# EAGLE design M_D_ext_power-gv (EAGLE 9.6.2)
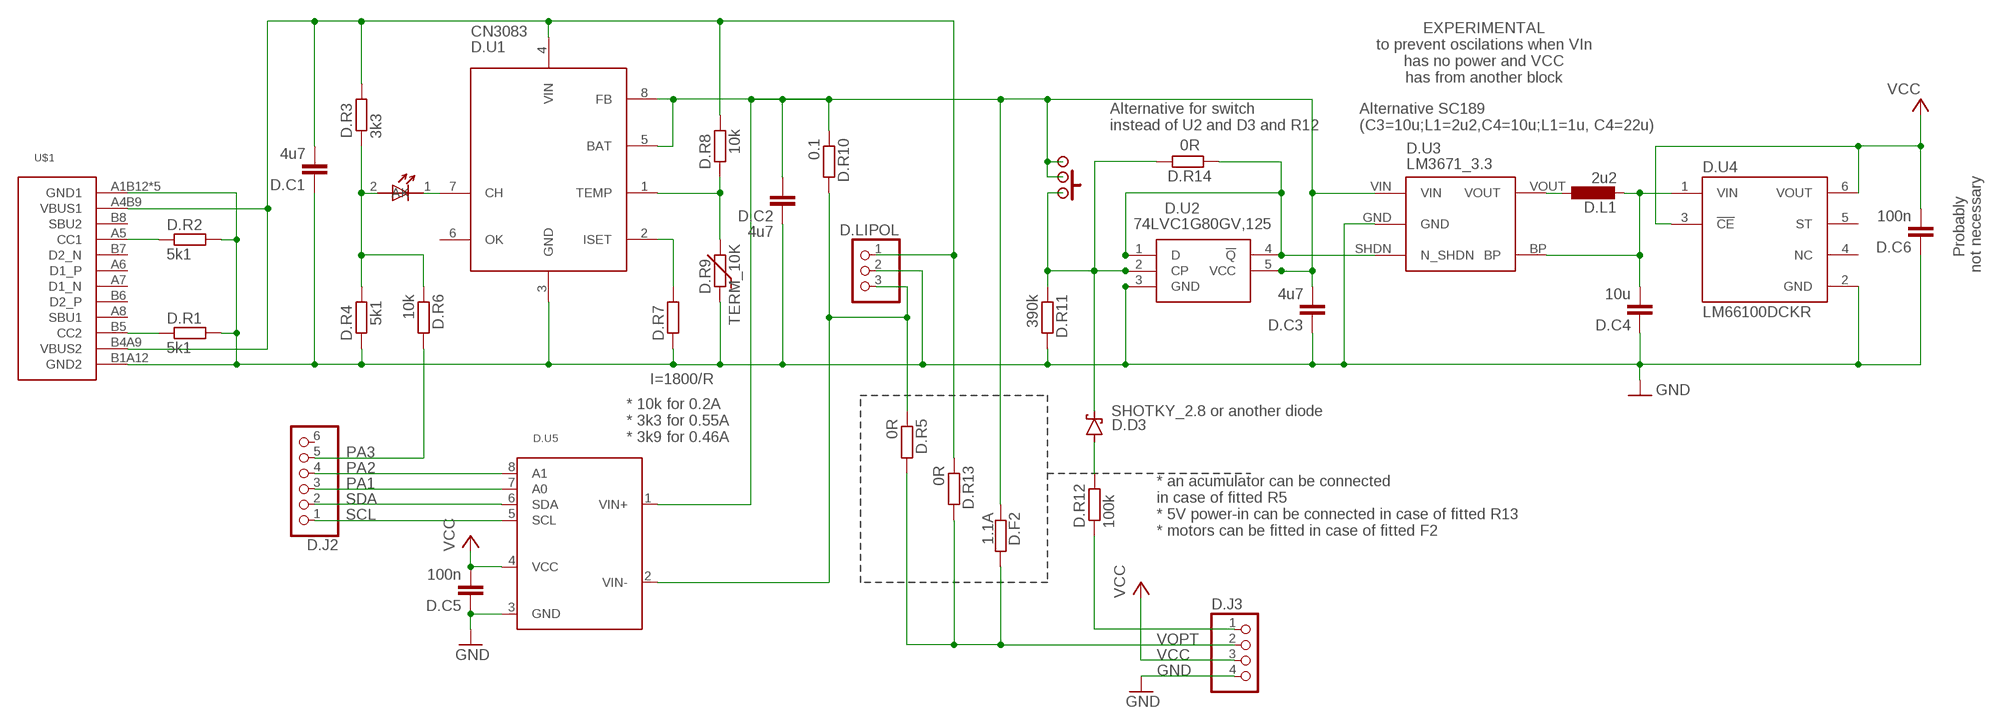
[diagram p0: schematic, sheet 1]

## Parts
D.C1  4u7  C-EUC0603  [C0603]
D.C2  4u7  C-EUC0603  [C0603]
D.C3  4u7  C-EUC0603  [C0603]
D.C4  10u  C-EUC0603  [C0603]
D.C5  100n  C-EUC0603  [C0603]
D.C6  100n  C-EUC0603  [C0603]
D.D1  LED_1.8  [LED_1.8]
D.D3  SHOTKY_2.8 or another diode  SHOTKY_2.8  [SHOTKY_2.8]
D.F2  1.1A  R-EU_R0805  [R0805]
D.J2  PINHD-1X6  [1X06]
D.J3  PINHD-1X4  [1X04]
D.L1  2u2  L-EUL3230M  [L3230M]
D.LIPOL  PINHEAD-1X3-2  [1X-03-2]
D.ON/OFF/RESET  SWITCH  [SWITCH]
D.R1  5k1  R-EU_R0603  [R0603]
D.R2  5k1  R-EU_R0603  [R0603]
D.R3  3k3  R-EU_R0603  [R0603]
D.R4  5k1  R-EU_R0603  [R0603]
D.R5  0R  R-EU_R0603  [R0603]
D.R6  10k  R-EU_R0603  [R0603]
D.R7  I=1800/R  R-EU_R0603  [R0603]
D.R8  10k  R-EU_R0603  [R0603]
D.R9  TERM_10K  THERM  [THERM]
D.R10  0.1  R-EU_R0805  [R0805]
D.R11  390k  R-EU_R0603  [R0603]
D.R12  100k  R-EU_R0603  [R0603]
D.R13  0R  R-EU_R0603  [R0603]
D.R14  0R  R-EU_R0603  [R0603]
D.U1  CN3083  [SOP8]
D.U2  74LVC1G80GV,125  [SOT95P275X110-5N]
D.U3  LM3671_3.3  STABILISER_APE8865  [SOT32-5]
D.U4  LM66100DCKR  [SOT65P210X110-6N]
D.U5  INA219  [SOT23-8]
U$1  USB-C  [USB-C]

## Nets
5V: D.C1.2 D.LIPOL.1 D.R3.2 D.R8.2 D.R13.1 D.U1.4(VIN) U$1.A4B9(VBUS1) U$1.B4A9(VBUS2)
CHRG: D.D1.2(A) D.R3.1 D.R4.2 D.R6.1
GND: D.C1.1 D.C2.1 D.C3.1 D.C4.1 D.C5.1 D.C6.1 D.J3.4 D.LIPOL.2 D.R1.2 D.R2.2 D.R4.1 D.R7.1 D.R9.1 D.R11.2 D.U1.3(GND) D.U2.3(GND) D.U3.GND D.U4.2(GND) D.U5.3(GND) U$1.A1B12(GND1) U$1.B1A12(GND2) U$1.SH1(GND1) U$1.SH2(GND1) U$1.SH3(GND1) U$1.SH4(GND1)
IN+: D.C2.2 D.C3.2 D.F2.1 D.ON/OFF/RESET.P$2 D.ON/OFF/RESET.P$3 D.ON/OFF/RESET.P$4 D.ON/OFF/RESET.P$6 D.R10.1 D.U1.5(BAT) D.U1.8(FB) D.U2.5(VCC) D.U3.VIN D.U5.1(VIN+)
IN-: D.LIPOL.3 D.R5.1 D.R10.2 D.U5.2(VIN-)
N$1: D.R14.1 D.U2.1(D) D.U2.4(!Q) D.U3.SHDN(N_SHDN)
N$2: D.L1.1 D.U3.VOUT
N$3: D.D1.1(K) D.U1.7(CH)
N$4: D.R1.1 U$1.B5(CC2)
N$5: D.D3.A D.R12.2
N$6: D.R2.1 U$1.A5(CC1)
N$7: D.R7.2 D.U1.2(ISET)
N$8: D.R8.1 D.R9.2 D.U1.1(TEMP)
N$10: D.D3.K(C) D.ON/OFF/RESET.P$1 D.ON/OFF/RESET.P$5 D.ON/OFF/RESET.P$7 D.R11.1 D.R14.2 D.U2.2(CP)
PA1: D.J2.3 D.U5.7(A0)
PA2: D.J2.4 D.U5.8(A1)
PA3: D.J2.5 D.R6.2
PA5-1: D.J3.1 D.R12.1
SCL: D.J2.1 D.U5.5(SCL)
SDA: D.J2.2 D.U5.6(SDA)
VCC: D.C5.2 D.C6.2 D.J3.3 D.U4.3(!CE) D.U4.6(VOUT) D.U5.4(VCC)
VCC1: D.C4.2 D.L1.2 D.U3.BP D.U4.1(VIN)
VOPT: D.F2.2 D.J3.2 D.R5.2 D.R13.2
Unconnected: D.J2.6 D.U1.6(OK) D.U4.4(NC) D.U4.5(ST) U$1.A6(D1_P) U$1.A7(D1_N) U$1.A8(SBU1) U$1.B6(D2_P) U$1.B7(D2_N) U$1.B8(SBU2)

## Notes on the sheet
- EXPERIMENTAL
  to prevent oscilations when VIn
  has no power and VCC
  has from another block
- Alternative for switch
  instead of U2 and D3 and R12
- Alternative SC189
  (C3=10u;L1=2u2,C4=10u;L1=1u, C4=22u)
- Probably 
  not necessary
- * 10k for 0.2A
  * 3k3 for 0.55A
  * 3k9 for 0.46A
- * an acumulator can be connected 
  in case of fitted R5  
  * 5V power-in can be connected in case of fitted R13 
  * motors can be fitted in case of fitted F2

## Library data of the parts
D.C1-D.C6 = rcl:C-EU: CAPACITOR, European symbol; SPICEPREFIX: C
D.D1 = hugo:LED_1.8
D.D3 = hugo:SHOTKY_2.8
D.F2 D.R1-D.R8 D.R10-D.R14 = rcl:R-EU_: RESISTOR, European symbol; SPICEPREFIX: R
D.J2 = pinhead2:PINHD-1X6: PIN HEADER
D.J3 = pinhead2:PINHD-1X4: PIN HEADER
D.L1 = rcl:L-EU: INDUCTOR, European symbol; SPICEPREFIX: L
D.LIPOL = pinhead2:PINHEAD-1X3-2
D.ON/OFF/RESET = hugo:SWITCH
D.R9 = hugo:THERM
D.U1 = hugo:CN3083
D.U2 = 74LVC1G80GV_125:74LVC1G80GV,125: 74LVC1G80 - Single D-type flip-flop; positive-edge trigger@en-us Source: Datasheet <https://assets.nexperia.com/documents/data-sheet/74LVC1G80.pdf>; DESCRIPTION: 74LVC1G80 - Single D-type flip-flop; positive-edge trigger@en-us; HEIGHT: 1.1mm; MANUFACTURER_NAME: Nexperia; MANUFACTURER_PART_NUMBER: 74LVC1G80GV,125
D.U3 = !stavebnice03:STABILISER_APE8865
D.U4 = LM66100DCKR:LM66100DCKR: Check availability <https://pricing.snapeda.com/parts/LM66100DCKR/Texas%20Instruments/view-part?ref=eda>; AVAILABILITY: In Stock; CHECK_PRICES: https://www.snapeda.com/parts/LM66100DCKR/Texas+Instruments/view-part/?ref=eda; DESCRIPTION: 1.5-V to 5.5-V, 1.5-A, 0.5-µA IQ ideal diode with integrated FET; MF: Texas Instruments; MP: LM66100DCKR; PACKAGE: SOT-SC70-6 Texas Instruments; PRICE: None; SNAPEDA_LINK: https://www.snapeda.com/parts/LM66100DCKR/Texas+Instruments/view-part/?ref=snap
D.U5 = hugo:INA219: INA219 - I2C Current/Power Monitor Voltage Range: 0-26V Accuracy: 0.5% Temperature: -40°C - 125°C
U$1 = hugo:USB-C

## Board
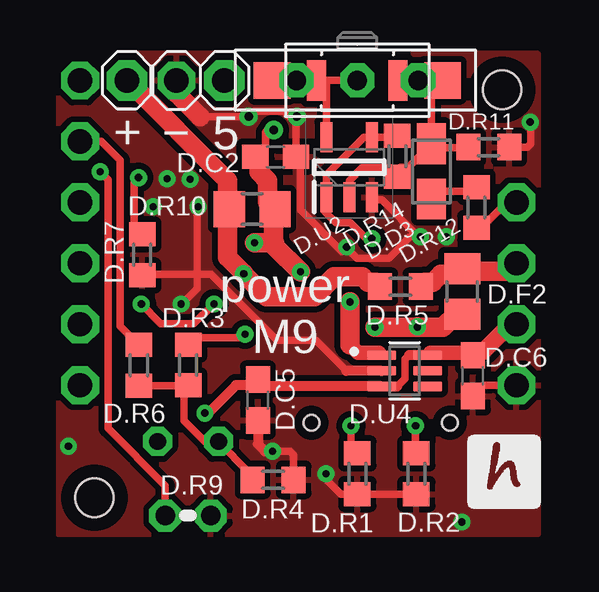
[diagram p1: board, top side]
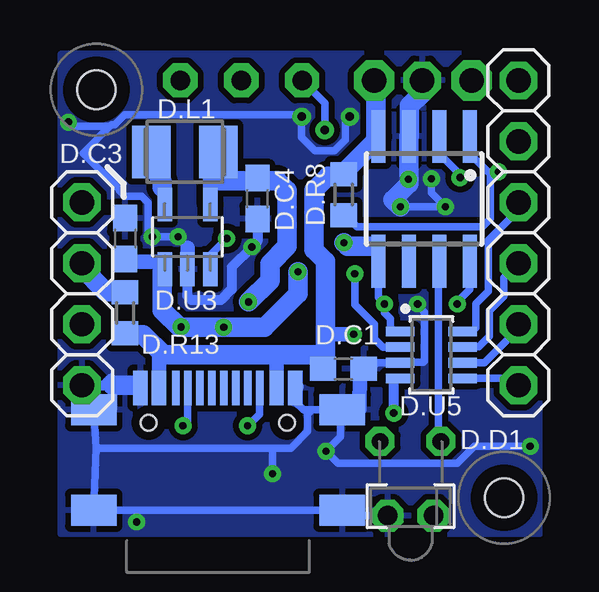
[diagram p2: board, bottom side, seen from below]

No outline drawn. Coordinates in mm, seen from the top.
Copper layers (1*16): Top 0.035mm / dielectric 1.5mm / Bottom 0.035mm
Design rules "default *": minimum track width 10mil, minimum drill 0.3mm, track to track 6mil, track to pad 6mil, pad to pad 6mil, via to via 10mil, smd to smd 10mil, copper to edge 15mil, drill to drill 15mil, minimum pad ring 10mil, minimum via ring 8mil, stop-mask expansion 4mil, vias tented up to drill 14mil, thermal gap 10mil
Holes 1.6 mm at 2,2 19,19
tRestrict: area 18,18 to 20,20; area 1,1 to 3,3
bRestrict: area 1,1 to 3,3; area 18,18 to 20,20

### Footprints (pad centres in the part's own frame; a part is rotated, then mirrored left to right if it is on the bottom)
C0603 = smd 1.1 x 1: 1 -0.85,0; 2 0.85,0
LED_1.8 = drill 0.7 octagon: 1 -1.27,-0.4; 2 1.27,-0.4
SHOTKY_2.8 = smd 1.7 x 1.2: A -1.15,0; K 1.15,0
R0805 = smd 1.3 x 1.5: 1 -0.95,0; 2 0.95,0
1X06 = drill 1.016 pad 1.575 octagon: 1 -6.35,0; 2 -3.81,0; 3 -1.27,0; 4 1.27,0; 5 3.81,0; 6 6.35,0
1X04 = drill 1.016 pad 1.575 octagon: 1 -3.81,0; 2 -1.27,0; 3 1.27,0; 4 3.81,0
L3230M = smd 1.6 x 2.2: 1 -1.4,0; 2 1.4,0
1X-03-2 = drill 1.016 pad 1.676 octagon: 1 -2.016,0; 3 2.048,0 | drill 1.016 pad 1.575 octagon: 2 -0.016,0
SWITCH = drill 0.8 pad 1.422 octagon: P$1 2.54,0; P$2 0,0; P$3 -2.54,0 | smd 0.8 x 1.7: P$4 -1.7,0; P$5 1.7,0 | smd 1.524 x 1.524: P$6 -3.556,0; P$7 3.556,0
R0603 = smd 1 x 1.1: 1 -0.85,0; 2 0.85,0
THERM = drill 0.813 octagon: 1 -0.953,0; 2 0.953,0
SOP8 = smd 0.6 x 2.2: 1 -1.905,-2.6; 2 -0.635,-2.6; 3 0.635,-2.6; 4 1.905,-2.6; 5 1.905,2.6; 6 0.635,2.6; 7 -0.635,2.6; 8 -1.905,2.6
SOT95P275X110-5N = smd 1.25 x 0.5: 1 -1.25,0.95; 2 -1.25,0; 3 -1.25,-0.95; 4 1.25,-0.95; 5 1.25,0.95
SOT32-5 = smd 0.6 x 1.4: BP 0.95,1.35; GND 0,-1.35; SHDN 0.95,-1.35; VIN -0.95,-1.35; VOUT -0.95,1.35
SOT65P210X110-6N = smd 1.19 x 0.4: 1 -0.96,0.65; 2 -0.96,0; 3 -0.96,-0.65; 4 0.96,-0.65; 5 0.96,0; 6 0.96,0.65
SOT23-8 = smd 0.4 x 1.2: 1 -0.975,-1.3; 2 -0.325,-1.3; 3 0.325,-1.3; 4 0.975,-1.3; 5 0.975,1.3; 6 0.325,1.3; 7 -0.325,1.3; 8 -0.975,1.3
USB-C = smd 0.6 x 1.45: A1B12 -3.235,3.825; A4B9 -2.46,3.825; B1A12 3.215,3.825; B4A9 2.44,3.825 | smd 0.3 x 1.45: A5 -1.26,3.825; A6 -0.26,3.825; A7 0.24,3.825; A8 1.24,3.825; B5 1.74,3.825; B6 0.74,3.825; B7 -0.76,3.825; B8 -1.76,3.825 | smd 1.9 x 1.3: SH1 -5.18,2.91; SH2 -5.18,-1.27; SH3 5.18,-1.27; SH4 5.18,2.91 | hole 0.65: 2.88,2.38; -2.9,2.38

### Placement (x,y rotation side)
D.C1  8.7,7.38 180 bottom
D.C2  9.56,16.21 180 top
D.C3  17.81,12.8 270 bottom
D.C4  12.29,14.47 90 bottom
D.C5  8.81,6.07 90 top
D.C6  17.78,7.09 90 top
D.D1  5.9,3.95 180 bottom
D.D3  16.05,15.6 90 top
D.F2  17.34,10.6 90 top
D.J2  1.4,13.04 90 bottom
D.J3  19.6,10.5 270 bottom
D.L1  15.32,16.41 0 bottom
D.LIPOL  5.4,19.39 180 top
D.ON/OFF/RESET  12.96,19.39 0 top
D.R1  12.96,3 270 top
D.R2  15.42,3 270 top
D.R3  5.91,7.54 90 top
D.R4  9.45,2.74 180 top
D.R5  14.76,10.79 0 top
D.R6  3.85,7.52 90 top
D.R7  4,12.12 90 top
D.R8  8.69,14.63 90 bottom
D.R9  5.9,1.25 180 top
D.R10  8.58,14.03 180 top
D.R11  18.44,16.61 0 top
D.R12  17.93,14.1 90 top
D.R13  17.81,9.7 90 bottom
D.R14  14.63,16.23 270 top
D.U1  5.33,14.45 180 bottom
D.U2  12.62,15.77 90 top
D.U3  15.2,12.87 0 bottom
D.U4  14.94,7.29 0 top
D.U5  5.03,7.95 270 bottom
U$1  13.93,2.75 0 bottom

### Tracks (layer width: path | path; a pad name or v marks a point on that pad's centre or on a via)
5V  (via drill 0.3)
  Top 0.305: D.R3.2 6.19,8.66 8.13,8.66 v8.28,8.81
  Bottom 0.254: 16.28,7.96 16.2,7.96
  Bottom 0.305: 9.4,8.81 9.45,8.76
  Bottom 0.61: 11.49,7.02 U$1.B4A9 11.49,7.87 11.4,7.96 | D.R8.2 8.79,15.48 8.87,15.4 | U$1.A4B9 16.39,7.84 16.28,7.96 | 7.34,17.15 D.U1.4 7.44,16.85 7.44,16.8 | v8.28,8.81 9.4,8.81
  Bottom 0.813: D.R8.2 8.69,15.55 7.44,16.8 | 8.87,15.4 9.34,15.4 9.93,14.81 9.93,12.32 9.45,11.84 9.45,8.76 9.45,7.97 9.46,7.96 9.65,7.96 | D.C1.2 9.64,7.46 9.65,7.96 | 9.65,7.96 11.4,7.96 16.2,7.96 17.04,8.8 17.75,8.8 D.R13.1 | 7.34,17.15 7.34,18.88 7.67,19.21 D.LIPOL.1
CHRG
  Top 0.305: D.R4.2 8.6,2.9 7.05,4.45 7.05,4.35 D.D1.2 7.16,4.34 6.61,4.34 5.74,5.2 5.74,6.59 | D.R6.1 5.69,6.67 5.69,6.59 5.74,6.59 | 5.74,6.59 5.82,6.59 D.R3.1
  Bottom 0.305: D.D1.2
GND  (via drill 0.3, 0.35)
  Top 0.305: v11.65,3 11.65,2.77 12.27,2.15 D.R1.2 D.R2.2 | 6.29,11.3 6.29,10.71 5.65,10.07 v5.61,10.07 | 6.29,11.3 6.29,14.12 v6.33,14.12 | 10.36,17.65 10.4,17.61 D.C2.1 10.4,16.13 10.59,16.13 10.59,13.99 12.33,12.26 12.51,12.44 | 10.36,17.65 9.91,18.11 8.66,18.11 v8.43,17.88 6.4,17.88 | 12.51,12.44 12.95,11.99 14.28,11.99 15.16,12.88 v15.6,12.88 15.52,12.88 13.99,14.41 13.57,14.41 D.U2.3 | v9.42,3.94 10.15,3.94 10.3,3.79 D.R4.1 | D.R7.1 4.03,11.3 6.29,11.3 | v12.52,12.45 12.51,12.44 | 12.5,7.29 11.23,8.56 9.6,8.56 6.86,11.3 6.29,11.3 | D.C6.1 18.23,6.69 D.J3.4 | 10.36,17.65 10.44,17.73 v10.44,17.88 | v20.17,17.65 20.19,17.63 20.19,16.75 20.05,16.61 D.R11.2
  Top 0.406: D.C5.1 8.81,4.23 9.11,3.94 v9.42,3.94 | D.U4.2 12.5,7.29
  Top 0.61: 5.44,18.84 5.42,18.89 D.LIPOL.2
  Top 0.813: 6.4,17.88 5.44,18.84
  Bottom 0.305: 11.65,4.07 18.99,4.07 19.01,4.09 | U$1.SH4 8.92,5.71 9.45,5.71 9.33,5.59 8.81,5.59 | U$1.SH1 19.01,4.09 | 19.01,4.09 U$1.SH2 U$1.SH3 8.64,1.25 D.R9.1 | 11.65,3.13 v11.65,3 | v11.65,3 11.63,2.97 | v11.65,3 11.65,4.07 | 8.04,5.68 8.13,5.59 8.81,5.59 | 8.01,7.22 D.C1.1 7.55,7.38 7.3,7.62 D.U5.3 6.31,7.64 5.37,7.64 5.32,7.7 5.32,9.73 5.65,10.06 5.65,10.07 v5.61,10.07 | U$1.B1A12 10.71,6.01 10.37,5.66 U$1.SH4 | 11.65,4.07 10.89,4.07 10.19,4.78 10.19,5.49 10.02,5.66 U$1.SH4 | 18.44,17.48 19.99,17.48 v20.17,17.65 | 15.2,12.41 15.68,12.88 16.59,12.88 16.82,13.12 16.84,13.12 16.84,14.3 17.11,14.57 17.8,14.57 18.06,14.82 18.06,14.86 19.56,16.36 18.44,17.48 | v0.91,4.14 3.24,4.14 3.95,3.44 8.93,3.44 v9.42,3.94 8.81,4.55 8.81,5.59 | v6.33,14.12 v4.45,14.12 5.03,14.71 v5.03,15.29 | 18.44,17.48 18.36,17.55 18.24,17.55 17.83,17.96 10.52,17.96 v10.44,17.88 10.44,17.03 9.88,16.46 9.08,16.46 8.62,16.92 8.62,17.7 v8.43,17.88
  Bottom 0.406: 18.37,6.98 18.5,6.85 | 18.5,6.85 18.66,6.69 | U$1.A1B12 17.16,6.6 17.33,6.77 17.41,6.69 | 18.66,6.69 D.J3.4 19.6,6.25 | 18.66,6.69 18.31,6.69 | 18.5,6.85 18.34,6.68 18.34,5.71 | D.C4.1 12.29,12.68 v12.52,12.45 13.36,11.61 13.36,10.68 13.8,10.24 15.04,10.24 15.2,10.4 D.U3.GND
  Bottom 0.61: 8.81,5.84 8.87,5.79 U$1.SH4 8.74,5.79 | 19.6,6.25 U$1.SH1 | U$1.B1A12 10.66,6.63 | D.U1.3 5.97,18.23 | 8.04,5.68 8.01,7.22 | D.U3.GND 15.2,12.41 | D.LIPOL.2 5.42,18.86
  Bottom 0.813: 18.31,6.69 17.41,6.69 | v6.33,14.12 6.63,14.43 5.97,15.09 D.U1.3 5.94,17.08 5.94,18.33 5.42,18.86
  other vias: 5.99,15.27 16.67,12.88 17.32,0.99
  pour Top (isolate 0.254): 0.5,20.5 0.5,0.5 20.5,0.5 20.5,20.5
  pour Bottom (isolate 0.254, rank 3): 0.5,20.5 20.5,20.5 20.5,0.5 0.5,0.5
IN+  (via drill 0.3, 0.35)
  Top 0.305: D.ON/OFF/RESET.P$6 D.ON/OFF/RESET.P$3 D.ON/OFF/RESET.P$4 11.68,19.39 | D.ON/OFF/RESET.P$2 11.68,19.39 | v3.96,10.07 4.77,9.26 6.13,9.26 v6.99,10.07 | D.C2.2 9.14,16.64 9.14,17.24 9.22,17.33 v9.48,17.33 | D.U2.5 11.67,19.38 11.68,19.39
  Top 0.508: 14.79,9.1 15.32,9.1
  Top 0.61: v8.68,12.62 9.52,12.62
  Top 0.813: D.R10.1 9.22,14.33 9.22,15.21 8.86,15.58 8.86,16.06 D.C2.2 | D.R10.1 9.61,14.03 | D.R10.1 9.47,13.97 9.47,12.62 v8.68,12.62 | 17.35,9.6 17.34,9.61 D.F2.1 17.08,9.65 16.54,9.1 15.45,9.1 | v15.47,9.12 15.45,9.1 | 15.45,9.1 15.32,9.1 14.83,9.1 | v13.69,9.1 14.79,9.1 | 9.52,12.62 9.52,12.49 v10.59,11.42
  Bottom 0.305: D.U3.VIN 16.15,11.82 | D.C3.2 17.59,11.74 17.6,11.82 | 13.51,9.28 v13.69,9.1 | D.U5.1 6.56,8.93 6.74,9.1 6.74,9.47 6.99,9.72 v6.99,10.07 7.24,10.36 D.U1.5 | v3.96,10.07 3.96,10.16 3.43,10.68 D.U1.8 | v9.48,17.33 9.48,18.45 D.ON/OFF/RESET.P$3
  Bottom 0.508: 7.37,12.47 7.24,12.6 | 7.24,12.42 7.19,12.47
  Bottom 0.61: 7.24,12.45 D.U1.5 7.24,12.42 7.24,12.6 | 17.6,11.82 16.15,11.82 | D.U3.VIN 16.25,11.42
  Bottom 0.813: v8.68,12.62 8.53,12.47 7.37,12.47 | 16.25,11.42 16.25,9.82 15.54,9.1 v13.69,9.1 11.98,9.1 10.59,10.49 v10.59,11.42
IN-  (via drill 0.3)
  Top 0.813: D.LIPOL.3 3.38,19.39 7.55,15.22 7.55,14.33 7.62,14.25 D.R10.2 7.62,13.57 7.54,13.49 7.54,12.03 8.23,11.35 v8.23,11.33 9.18,10.38 11.17,10.38 11.99,11.2 13.17,11.2 13.4,10.97 13.73,10.97 D.R5.1
  Bottom 0.305: D.U5.2 6.34,8.27 7.05,8.27 7.41,8.63 7.41,9.23 8.23,10.04 v8.23,11.33
N$1  (via drill 0.3)
  Top 0.305: D.R14.1 14.57,17.02 D.U2.4 13.23,17.02 11.67,15.46 D.U2.1 11.61,14.46 11.61,13.93 12.07,13.47 12.68,13.47 13.35,12.8 v13.56,12.8
  Bottom 0.305: D.U3.SHDN 14.25,12.11 v13.56,12.8
N$2
  Bottom 0.305: 16.25,14.93 16.15,14.83 D.U3.VOUT
  Bottom 0.61: D.L1.1 16.72,15.62 16.25,15.16
  Bottom 0.813: 16.25,15.16 16.25,14.93
N$3
  Bottom 0.305: D.U1.7 4.75,11.8 4.75,4.47 D.D1.1
N$4  (via drill 0.3)
  Top 0.305: D.R1.1 12.69,4.14 v12.69,5
  Bottom 0.305: U$1.B5 12.19,5.48 12.67,5 v12.69,5
N$5
  Top 0.305: D.R12.2 17.52,14.78 16.38,14.78 D.D3.A
N$6  (via drill 0.3)
  Top 0.305: D.R2.1 15.39,3.88 v15.39,5
  Bottom 0.305: U$1.A5 15.19,5.2 v15.39,5
N$7  (via drill 0.3)
  Top 0.305: v3.83,15.34 3.66,15.16 3.66,13.31 D.R7.2
  Bottom 0.305: D.U1.2 4.57,16.93 4.57,16.21 3.83,15.48 v3.83,15.34
N$8  (via drill 0.3)
  Top 0.305: D.R9.2 4.95,2.51 2.56,4.89 2.56,15.26 v2.24,15.59
  Bottom 0.305: D.U1.1 3.4,17.03 3.4,16.32 2.67,15.59 v2.24,15.59 2.42,15.59 2.57,15.43 2.57,13.63 2.9,13.3 8.13,13.3 8.61,13.78 D.R8.1
N$10
  Top 0.305: D.ON/OFF/RESET.P$1 D.ON/OFF/RESET.P$5 15.85,19.39 16.05,19.18 D.D3.K | D.ON/OFF/RESET.P$1 15.36,19.35 | D.ON/OFF/RESET.P$1 D.ON/OFF/RESET.P$7 | 17.36,16.84 D.R11.1 17.57,16.59 16.2,16.59 D.D3.K | 14.25,15.38 D.R14.2 14.63,15.49 | 14.63,15.49 14.63,15.65 14.76,15.78 15.09,15.78 D.D3.K | D.U2.2 12.62,15.21 13.16,15.75 14.38,15.75 14.63,15.49
PA1
  Bottom 0.305: D.U5.7 3.71,8.29 3.05,8.29 2.62,8.73 2.62,9.78 2.01,10.39 2.01,11.16 D.J2.3
PA2
  Bottom 0.305: D.J2.4 1.4,13.98 2.65,12.73 2.65,10.6 3.17,10.08 3.17,9.08 3.32,8.93 D.U5.8
PA3
  Top 0.305: D.R6.2 3.07,9.15 3.07,16.07 2.29,16.85 D.J2.5
PA5-1
  Top 0.305: D.R12.1 18.09,13.4 18.28,13.4 19.19,14.31 D.J3.1
SCL
  Bottom 0.305: D.U5.5 1.69,6.97 D.J2.1
SDA
  Bottom 0.305: D.J2.2 1.4,9.04 2.82,7.62 D.U5.6
VCC  (via drill 0.3)
  Top 0.305: 14.62,6.63 14.95,6.97 14.95,7.77 15.12,7.94 | D.U4.6 16,8.05 | D.C6.2 19.07,9.23 D.J3.3
  Top 0.406: v6.6,5.53 6.74,5.53 7.9,6.69 8.59,6.69 D.C5.2 9.09,6.64 D.U4.3 14.62,6.63 | D.U4.6 15.12,7.94
  Top 0.61: D.J3.3 19.4,9.23 18.21,8.05 16,8.05
  Bottom 0.305: 6.6,6.8 6.43,6.97 D.U5.4
  Bottom 0.406: v6.6,5.53 6.6,6.8
VCC1  (via drill 0.3)
  Top 0.305: D.U4.1 13.87,8.04
  Top 0.61: v12.65,10.16 | 13.87,8.04 12.99,8.04 12.65,8.38
  Top 0.813: v12.65,10.16 12.65,8.38
  Bottom 0.406: D.U3.BP 14.25,14.45 | D.C4.2 12.18,15.21 12.13,15.21
  Bottom 0.508: 14.25,16.07 D.L1.2
  Bottom 0.61: D.U3.BP 14.25,16.07
  Bottom 0.813: v12.65,10.16 11.76,11.05 11.76,11.76 11.05,12.47 11.05,14.81 11.45,15.21 12.13,15.21 | 14.07,16.25 D.L1.2 13.92,15.9 | 13.92,15.9 13.89,15.88 | 13.92,15.9 13.92,15.21 12.39,15.21 D.C4.2
VOPT
  Top 0.813: D.J3.2 19.27,11.44 17.45,11.44 D.F2.2 17.09,11.3 16.45,11.3 16.11,10.97 15.79,10.97 D.R5.2
  Bottom 0.813: D.R13.2 17.84,10.59 18.61,10.59 19.6,11.58 D.J3.2

### Text on the board
tPlace: + | − | 5 | power / M9